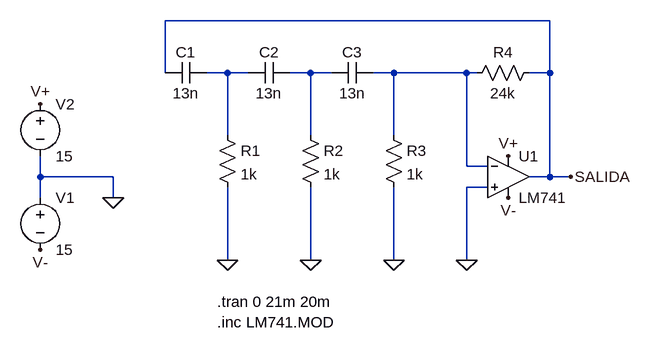
[diagram p0: schematic lm741-oscilador-RC.asc]
lm741-oscilador-RC.asc, the LTspice schematic file:
Version 4
SHEET 1 1012 680
WIRE 176 -48 -416 -48
WIRE -416 32 -416 -48
WIRE -320 32 -352 32
WIRE -288 32 -320 32
WIRE -192 32 -224 32
WIRE -160 32 -192 32
WIRE -64 32 -96 32
WIRE 48 32 -64 32
WIRE 64 32 48 32
WIRE 176 32 176 -48
WIRE 176 32 144 32
WIRE -320 128 -320 32
WIRE -192 128 -192 32
WIRE -64 128 -64 32
WIRE 48 176 48 32
WIRE 80 176 48 176
WIRE -608 192 -608 160
WIRE -496 192 -608 192
WIRE 176 192 176 32
WIRE 176 192 144 192
WIRE 208 192 176 192
WIRE 80 208 48 208
WIRE -608 224 -608 192
WIRE -496 224 -496 192
WIRE -320 320 -320 208
WIRE -192 320 -192 208
WIRE -64 320 -64 208
WIRE 48 320 48 208
FLAG -192 320 0
FLAG -320 320 0
FLAG 112 160 V+
FLAG 48 320 0
FLAG 112 224 V-
FLAG -64 320 0
FLAG -496 224 0
FLAG -608 80 V+
FLAG -608 304 V-
FLAG 208 192 SALIDA
SYMBOL MisComponentes\\LM741 112 128 R0
SYMATTR InstName U1
SYMBOL res 160 16 R90
WINDOW 0 0 56 VBottom 2
WINDOW 3 32 56 VTop 2
SYMATTR InstName R4
SYMATTR Value 24k
SYMBOL res -336 112 R0
SYMATTR InstName R1
SYMATTR Value 1k
SYMBOL res -208 112 R0
SYMATTR InstName R2
SYMATTR Value 1k
SYMBOL cap -352 16 R90
WINDOW 0 0 32 VBottom 2
WINDOW 3 32 32 VTop 2
SYMATTR InstName C1
SYMATTR Value 13n
SYMBOL cap -224 16 R90
WINDOW 0 0 32 VBottom 2
WINDOW 3 32 32 VTop 2
SYMATTR InstName C2
SYMATTR Value 13n
SYMBOL cap -96 16 R90
WINDOW 0 0 32 VBottom 2
WINDOW 3 32 32 VTop 2
SYMATTR InstName C3
SYMATTR Value 13n
SYMBOL res -80 112 R0
SYMATTR InstName R3
SYMATTR Value 1k
SYMBOL voltage -608 208 R0
WINDOW 123 0 0 Left 0
WINDOW 39 0 0 Left 0
SYMATTR InstName V1
SYMATTR Value 15
SYMBOL voltage -608 64 R0
WINDOW 123 0 0 Left 0
WINDOW 39 0 0 Left 0
SYMATTR InstName V2
SYMATTR Value 15
TEXT -336 416 Left 2 !.inc LM741.MOD
TEXT -336 384 Left 2 !.tran 0 21m 20m

The netlist it stands for:
* lm741-oscilador-RC.asc
XU1 0 N003 V+ V- SALIDA LM741  ; pins In+ In- V+ V- OUT
R4 SALIDA N003 24k
R1 N001 0 1k
R2 N002 0 1k
C1 N001 SALIDA 13n
C2 N002 N001 13n
C3 N003 N002 13n
R3 N003 0 1k
V1 0 V- 15
V2 V+ 0 15
.inc LM741.MOD
.tran 0 21m 20m
.lib LM741.lib
.backanno
.end